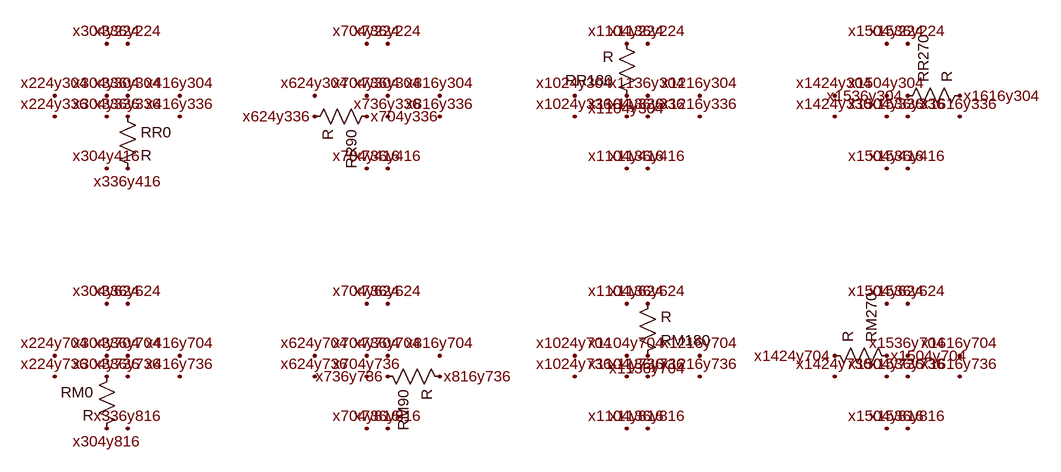
[diagram p0: schematic orientation_res.asc]
orientation_res.asc, the LTspice schematic file:
Version 4
SHEET 1 2000 1200
FLAG 304 304 x304y304
FLAG 304 336 x304y336
FLAG 336 304 x336y304
FLAG 336 336 x336y336
FLAG 224 304 x224y304
FLAG 224 336 x224y336
FLAG 304 224 x304y224
FLAG 304 416 x304y416
FLAG 336 224 x336y224
FLAG 336 416 x336y416
FLAG 416 304 x416y304
FLAG 416 336 x416y336
FLAG 704 304 x704y304
FLAG 704 336 x704y336
FLAG 736 304 x736y304
FLAG 736 336 x736y336
FLAG 624 304 x624y304
FLAG 624 336 x624y336
FLAG 704 224 x704y224
FLAG 704 416 x704y416
FLAG 736 224 x736y224
FLAG 736 416 x736y416
FLAG 816 304 x816y304
FLAG 816 336 x816y336
FLAG 1104 304 x1104y304
FLAG 1104 336 x1104y336
FLAG 1136 304 x1136y304
FLAG 1136 336 x1136y336
FLAG 1024 304 x1024y304
FLAG 1024 336 x1024y336
FLAG 1104 224 x1104y224
FLAG 1104 416 x1104y416
FLAG 1136 224 x1136y224
FLAG 1136 416 x1136y416
FLAG 1216 304 x1216y304
FLAG 1216 336 x1216y336
FLAG 1504 304 x1504y304
FLAG 1504 336 x1504y336
FLAG 1536 304 x1536y304
FLAG 1536 336 x1536y336
FLAG 1424 304 x1424y304
FLAG 1424 336 x1424y336
FLAG 1504 224 x1504y224
FLAG 1504 416 x1504y416
FLAG 1536 224 x1536y224
FLAG 1536 416 x1536y416
FLAG 1616 304 x1616y304
FLAG 1616 336 x1616y336
FLAG 304 704 x304y704
FLAG 304 736 x304y736
FLAG 336 704 x336y704
FLAG 336 736 x336y736
FLAG 224 704 x224y704
FLAG 224 736 x224y736
FLAG 304 624 x304y624
FLAG 304 816 x304y816
FLAG 336 624 x336y624
FLAG 336 816 x336y816
FLAG 416 704 x416y704
FLAG 416 736 x416y736
FLAG 704 704 x704y704
FLAG 704 736 x704y736
FLAG 736 704 x736y704
FLAG 736 736 x736y736
FLAG 624 704 x624y704
FLAG 624 736 x624y736
FLAG 704 624 x704y624
FLAG 704 816 x704y816
FLAG 736 624 x736y624
FLAG 736 816 x736y816
FLAG 816 704 x816y704
FLAG 816 736 x816y736
FLAG 1104 704 x1104y704
FLAG 1104 736 x1104y736
FLAG 1136 704 x1136y704
FLAG 1136 736 x1136y736
FLAG 1024 704 x1024y704
FLAG 1024 736 x1024y736
FLAG 1104 624 x1104y624
FLAG 1104 816 x1104y816
FLAG 1136 624 x1136y624
FLAG 1136 816 x1136y816
FLAG 1216 704 x1216y704
FLAG 1216 736 x1216y736
FLAG 1504 704 x1504y704
FLAG 1504 736 x1504y736
FLAG 1536 704 x1536y704
FLAG 1536 736 x1536y736
FLAG 1424 704 x1424y704
FLAG 1424 736 x1424y736
FLAG 1504 624 x1504y624
FLAG 1504 816 x1504y816
FLAG 1536 624 x1536y624
FLAG 1536 816 x1536y816
FLAG 1616 704 x1616y704
FLAG 1616 736 x1616y736
SYMBOL res 320 320 R0
SYMATTR InstName RR0
SYMBOL res 720 320 R90
SYMATTR InstName RR90
SYMBOL res 1120 320 R180
SYMATTR InstName RR180
SYMBOL res 1520 320 R270
SYMATTR InstName RR270
SYMBOL res 320 720 M0
SYMATTR InstName RM0
SYMBOL res 720 720 M90
SYMATTR InstName RM90
SYMBOL res 1120 720 M180
SYMATTR InstName RM180
SYMBOL res 1520 720 M270
SYMATTR InstName RM270

The netlist it stands for:
* orientation_res.asc
RR0 x336y336 x336y416 R
RR90 x704y336 x624y336 R
RR180 x1104y304 x1104y224 R
RR270 x1536y304 x1616y304 R
RM0 x304y736 x304y816 R
RM90 x736y736 x816y736 R
RM180 x1136y704 x1136y624 R
RM270 x1504y704 x1424y704 R
.backanno
.end